# EAGLE design rk097 - breakout (EAGLE 6.4)
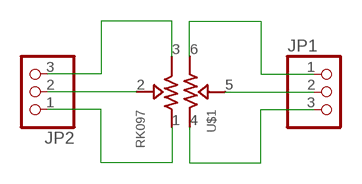
[diagram p0: schematic, sheet 1]

## Parts
JP1  PINHD-1X3  [1X03]
JP2  PINHD-1X3  [1X03]
U$1  RK097  [RK097]

## Nets
N$1: JP2.1 U$1.1
N$2: JP2.2 U$1.2
N$3: JP2.3 U$1.3
N$4: JP1.2 U$1.5
N$5: JP1.3 U$1.4
N$6: JP1.1 U$1.6

## Library data of the parts
JP1 JP2 = pinhead:PINHD-1X3: PIN HEADER
U$1 = SparkFun-Electromechanical:RK097

## Board
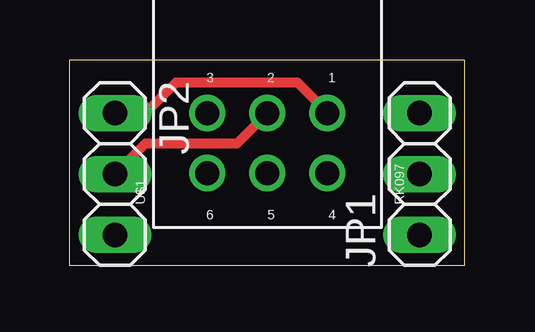
[diagram p1: board, top side]
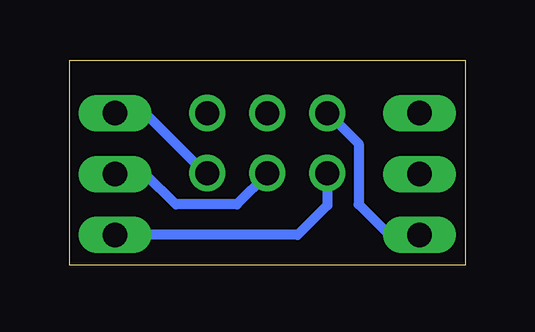
[diagram p2: board, bottom side, seen from below]

Size 16.49 x 8.56 mm. Coordinates in mm from the lower left corner, seen from the top.
Outline: 0,0 16.49,0 16.49,8.56 0,8.56 0,0
Copper layers (1*16): Top 0.035mm / dielectric 1.5mm / Bottom 0.035mm
Design rules "default": minimum track width 10mil, minimum drill 24mil, track to track 8mil, track to pad 8mil, pad to pad 8mil, via to via 8mil, smd to smd 8mil, copper to edge 40mil, drill to drill 8mil, minimum pad ring 10mil, minimum via ring 8mil, stop-mask expansion 4mil, vias tented up to drill 0mil, thermal gap 10mil

### Footprints (pad centres in the part's own frame; a part is rotated, then mirrored left to right if it is on the bottom)
1X03 = drill 1.016 long: 1 -2.54,0; 2 0,0; 3 2.54,0
RK097 = drill 1: 1 2.5,0; 2 0,0; 3 -2.5,0; 4 2.5,-2.5; 5 0,-2.5; 6 -2.5,-2.5

### Placement (x,y rotation side)
JP1  14.6,3.81 90 top
JP2  1.91,3.81 270 top
U$1  8.26,6.35 0 top

### Tracks (layer width: path | path; a pad name or v marks a point on that pad's centre or on a via)
N$1
  Top 0.406: U$1.1 10.76,6.39 9.52,7.62 4.45,7.62 3.17,6.35 JP2.1
N$2
  Top 0.406: U$1.2 6.98,5.08 3.17,5.08 JP2.2
N$3
  Bottom 0.406: U$1.3 5.72,6.35 4.45,5.08 4.45,2.54 3.17,1.27 JP2.3
N$4
  Bottom 0.406: U$1.5 8.26,3.81 9.52,2.54 12.06,2.54 13.34,3.81 JP1.2
N$5
  Bottom 0.406: U$1.4 10.84,3.85 13.34,6.35 JP1.3
N$6
  Bottom 0.406: U$1.6 5.76,2.5 6.98,1.27 JP1.1